# Altium project 0.96OLED_SSD1315.PrjPcb
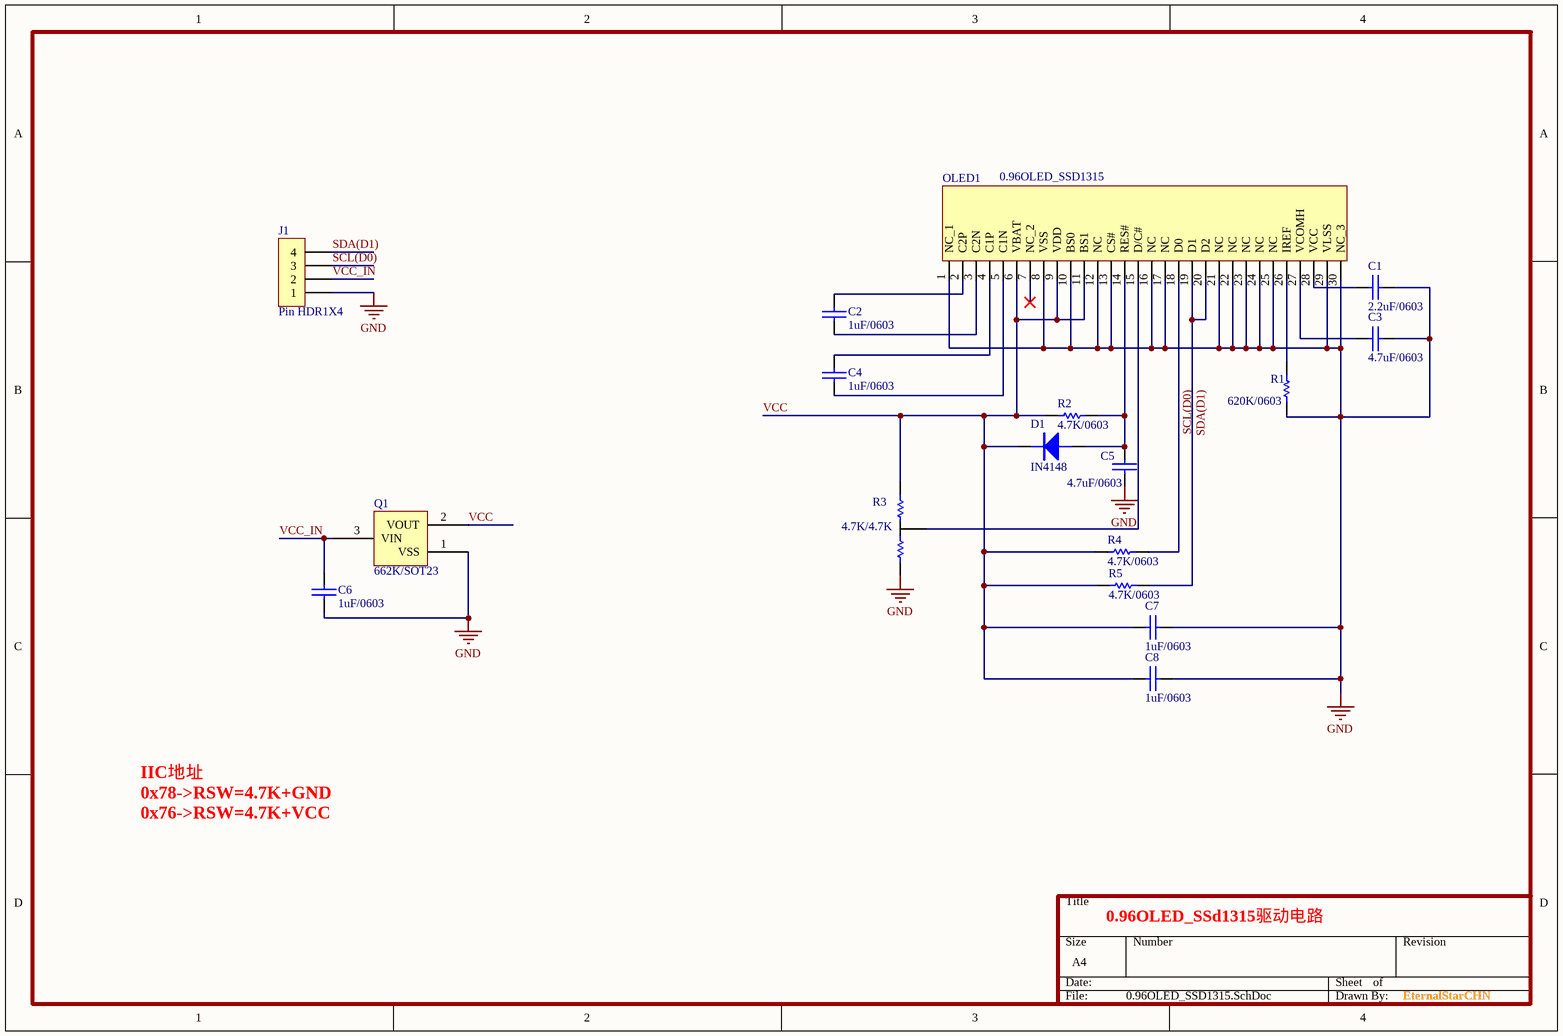
[diagram p0: 0.96OLED_SSD1315.SchDoc]
1 sheet, 17 parts. Net scope: global (net labels, ports and power ports of the same name join across sheets).
Board file: 0.96OLED_SSD1315.PcbDoc

## Sheet 0.96OLED_SSD1315.SchDoc
size A4

### Parts
C1  2.2uF/0603  [0603C]
C2  1uF/0603  [0603C]
C3  4.7uF/0603  [0603C]
C4  1uF/0603  [0603C]
C5  4.7uF/0603  [0603C]
C6  1uF/0603  [0603C]
C7  1uF/0603  [0603C]
C8  1uF/0603  [0603C]
D1  IN4148  [SOD-523]
J1  Pin HDR1X4  [Pin HDR1X4/2.54mm-S]
OLED1  0.96OLED_SSD1315  [OLED_0.96]
Q1  662K/SOT23  [SOT23]
R1  620K/0603  [0603R]
R2  4.7K/0603  [0603R]
R3  4.7K/4.7K  [SW_0603R]
R4  4.7K/0603  [0603R]
R5  4.7K/0603  [0603R]

### Nets
GND: C1.1 C3.1 C5.1 C6.2 C7.1 C8.1 J1.1 OLED1.1(NC_1) OLED1.8(VSS) OLED1.10(BS0) OLED1.12(NC) OLED1.13(CS#) OLED1.16(NC) OLED1.17(NC) OLED1.21(NC) OLED1.22(NC) OLED1.23(NC) OLED1.24(NC) OLED1.25(NC) OLED1.29(VLSS) OLED1.30(NC_3) Q1.1(VSS) R1.1 R3.3
SCL(D0): J1.3 OLED1.18(D0) R4.1
SDA(D1): J1.4 OLED1.19(D1) OLED1.20(D2) R5.1
VCC: C7.2 C8.2 D1.K OLED1.6(VBAT) OLED1.9(VDD) OLED1.11(BS1) Q1.2(VOUT) R2.2 R3.1 R4.2 R5.2
VCC_IN: C6.1 J1.2 Q1.3(VIN)
NetC1_2: C1.2 OLED1.28(VCC)
NetC2_1: C2.1 OLED1.3(C2N)
NetC2_2: C2.2 OLED1.2(C2P)
NetC3_2: C3.2 OLED1.27(VCOMH)
NetC4_1: C4.1 OLED1.5(C1N)
NetC4_2: C4.2 OLED1.4(C1P)
NetC5_2: C5.2 D1.A OLED1.14(RES#) R2.1
NetOLED1_15: OLED1.15(D/C#) R3.2
NetOLED1_26: OLED1.26(IREF) R1.2

Not connected (* = marked no-connect by the designer): OLED1 7(NC_2)*

### Notes on the sheet
- IIC地址
  0x78->RSW=4.7K+GND
  0x76->RSW=4.7K+VCC
- 0.96OLED_SSd1315驱动电路
- EternalStarCHN

### Library data of the parts
C1-C8 = CAP: 无极性电容
D1 = DIODE: 普通二极管
Q1 = LDO_SOT23: SOT23封装LDO
R1 R2 R4 R5 = RES
R3 = RES_SW